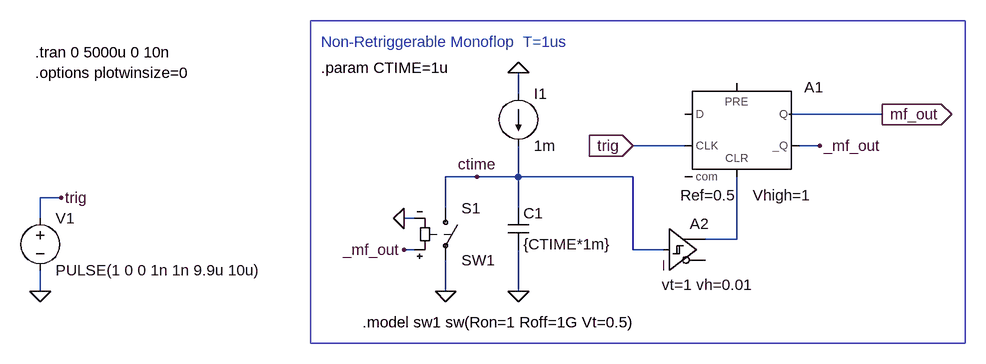
[diagram p0: schematic monoflop_a.asc]
monoflop_a.asc, the LTspice schematic file:
Version 4
SHEET 1 1112 680
WIRE 256 -48 256 -80
WIRE 816 -16 672 -16
WIRE 512 32 432 32
WIRE 720 32 688 32
WIRE 192 80 144 80
WIRE 256 80 256 32
WIRE 256 80 192 80
WIRE 432 80 256 80
WIRE -448 112 -480 112
WIRE 144 128 144 80
WIRE 256 128 256 80
WIRE -480 144 -480 112
WIRE 96 144 80 144
WIRE 592 176 592 80
WIRE 592 176 544 176
WIRE 96 192 80 192
WIRE 432 192 432 80
WIRE 480 192 432 192
WIRE -480 256 -480 224
WIRE 144 256 144 208
WIRE 256 256 256 192
FLAG 256 256 0
FLAG 256 -80 0
FLAG -480 256 0
FLAG 144 256 0
FLAG 80 144 0
FLAG -448 112 trig
FLAG 80 192 _mf_out
FLAG 192 80 ctime
FLAG 816 -16 mf_out
IOPIN 816 -16 Out
FLAG 720 32 _mf_out
FLAG 432 32 trig
IOPIN 432 32 In
SYMBOL cap 240 128 R0
SYMATTR InstName C1
SYMATTR Value {CTIME*1m}
SYMBOL current 256 -48 R0
SYMATTR InstName I1
SYMATTR Value 1m
SYMBOL voltage -480 128 R0
WINDOW 123 0 0 Left 0
WINDOW 39 0 0 Left 0
SYMATTR InstName V1
SYMATTR Value PULSE(1 0 0 1n 1n 9.9u 10u)
SYMBOL sw 144 112 R0
SYMATTR InstName S1
SYMATTR Value SW1
SYMBOL Digital\\dflop 592 -64 R0
WINDOW 39 -87 172 Left 0
SYMATTR SpiceLine Ref=0.5    Vhigh=1
SYMATTR InstName A1
SYMATTR Value2 trise=5n tripdt=1n
SYMBOL Digital\\schmitt 480 128 R0
WINDOW 123 -3 118 Left 0
SYMATTR InstName A2
SYMATTR Value2 vt=1 vh=0.01
TEXT 16 304 Left 0 !.model sw1 sw(Ron=1 Roff=1G Vt=0.5)
TEXT -488 -112 Left 0 !.tran 0 5000u 0 10n
TEXT -48 -88 Left 0 !.param CTIME=1u
TEXT -488 -80 Left 0 !.options plotwinsize=0
TEXT -48 -128 Left 0 ;Non-Retriggerable Monoflop  T=1us
RECTANGLE Normal 944 336 -64 -160

The netlist it stands for:
* monoflop_a.asc
C1 ctime 0 {CTIME*1m}
I1 0 ctime 1m
V1 trig 0 PULSE(1 0 0 1n 1n 9.9u 10u)
S1 ctime 0 _mf_out 0 SW1
A1 0 0 trig 0 N001 _mf_out mf_out 0 DFLOP trise=5n tripdt=1n Ref=0.5    Vhigh=1
A2 ctime 0 0 0 0 0 N001 0 SCHMITT vt=1 vh=0.01
.model sw1 sw(Ron=1 Roff=1G Vt=0.5)
.tran 0 5000u 0 10n
.param CTIME=1u
.options plotwinsize=0
* Non-Retriggerable Monoflop  T=1us
.backanno
.end